# EAGLE design JustABatterie (EAGLE 7.2.0)
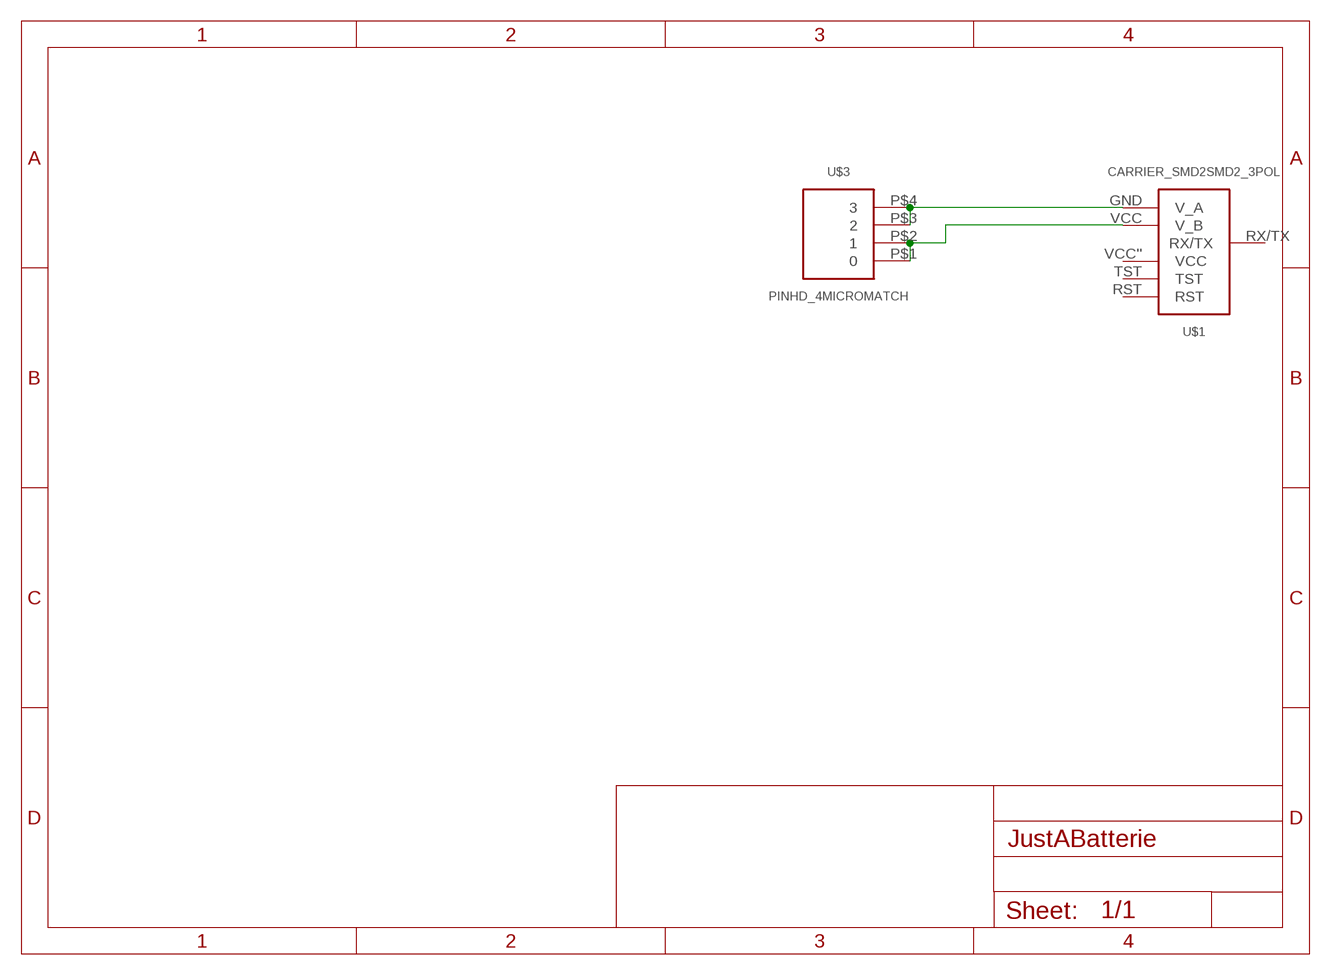
[diagram p0: schematic, sheet 1]

## Parts
U$1  CARRIER_SMD2SMD2_3POL  [CARRIER_SMD2_3POL]
U$3  PINHD_4MICROMATCH  [MICROMATCH4P0L]

## Nets
N$2: U$1.GND(V_A) U$3.P$3 U$3.P$4
N$3: U$1.VCC(V_B) U$3.P$1 U$3.P$2
Unconnected: U$1.RST U$1.RX/TX U$1.TST U$1.VCC''(VCC)

## Library data of the parts
U$1 = thar:CARRIER_SMD2
U$3 = thar:PINHD_4

## Board
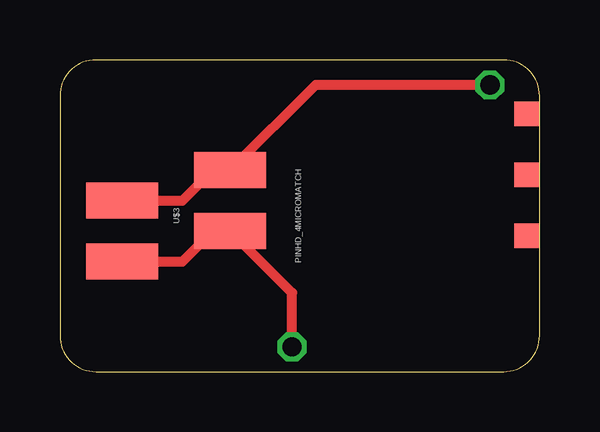
[diagram p1: board, top side]
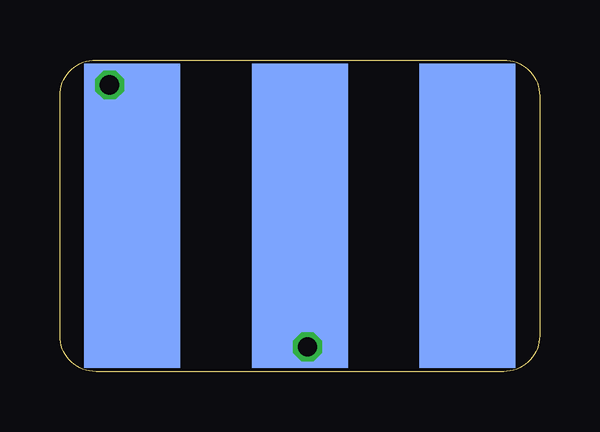
[diagram p2: board, bottom side, seen from below]

Size 20 x 13 mm. Coordinates in mm from the lower left corner, seen from the top.
Copper layers (1*16): Top 0.035mm / dielectric 1.5mm / Bottom 0.035mm
Design rules "Bilex DRU *": minimum track width 10mil, minimum drill 24mil, track to track 10mil, track to pad 10mil, pad to pad 10mil, via to via 10mil, smd to smd 10mil, copper to edge 1mil, drill to drill 8mil, minimum pad ring 10mil, minimum via ring 8mil, stop-mask expansion 4mil, vias tented up to drill 0mil, thermal gap 10mil

### Footprints (pad centres in the part's own frame; a part is rotated, then mirrored left to right if it is on the bottom)
CARRIER_SMD2_3POL = smd 4 x 12.7 bottom: GND -6.985,0; RX/TX 6.985,0; VCC 0,0 | smd 1.016 x 1.016: RST -9.461,0.826; TST -9.461,-1.714; VCC'' -9.461,-4.255
MICROMATCH4P0L = smd 1.5 x 3: P$1 -1.905,2.25; P$2 -0.635,-2.25; P$3 0.635,2.25; P$4 1.905,-2.25

### Placement (x,y rotation side)
U$1  10,6.5 180 top
U$3  4.85,6.5 90 top

### Tracks (layer width: path | path; a pad name or v marks a point on that pad's centre or on a via)
N$2  (via drill 0.8)
  Top 0.406: v17.93,11.96 10.66,11.96 U$3.P$4 6.98,8.28 6.25,8.28 5.11,7.13 U$3.P$3
  Bottom 0.254: U$1.GND 16.98,11.01 v17.93,11.96
  Bottom 0.406: v17.93,11.96 18,11.96 18,6.5
N$3  (via drill 0.8)
  Top 0.406: v9.68,1.04 9.68,3.29 U$3.P$2 6.38,5.86 5.11,4.59 U$3.P$1
  Bottom 0.254: U$1.VCC 10,1.36 v9.68,1.04